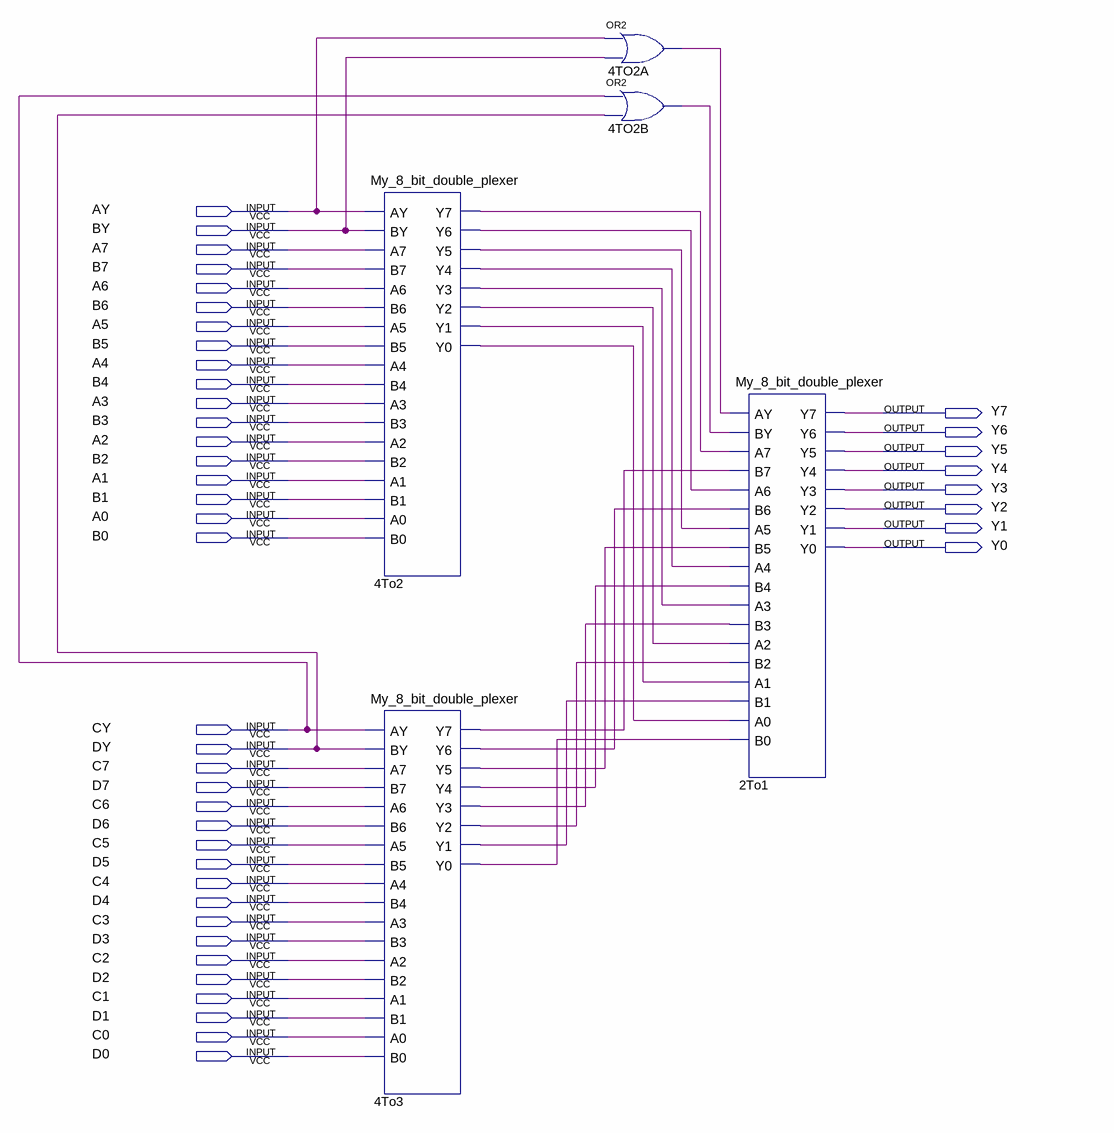
[diagram p0: schematic sheet]
// Quartus schematic My_8_bit_four_plexer.bdf as structural Verilog: 5 symbols, 44 pins
module My_8_bit_four_plexer (
  input  AY,
  input  BY,
  input  A7,
  input  B7,
  input  A6,
  input  B6,
  input  A5,
  input  B5,
  input  A4,
  input  B4,
  input  A3,
  input  B3,
  input  A2,
  input  B2,
  input  A1,
  input  B1,
  input  A0,
  input  B0,
  input  CY,
  input  DY,
  input  C7,
  input  D7,
  input  C6,
  input  D6,
  input  C5,
  input  D5,
  input  C4,
  input  D4,
  input  C3,
  input  D3,
  input  C2,
  input  D2,
  input  C1,
  input  D1,
  input  C0,
  input  D0,
  output Y7,
  output Y6,
  output Y5,
  output Y4,
  output Y3,
  output Y2,
  output Y1,
  output Y0
);

  wire n4To2_y0, n4To2_y1, n4To2_y2, n4To2_y3, n4To2_y4, n4To2_y5, n4To2_y6, n4To2_y7, n4TO2A_out,
       n4TO2B_out, n4To3_y0, n4To3_y1, n4To3_y2, n4To3_y3, n4To3_y4, n4To3_y5, n4To3_y6, n4To3_y7;

  My_8_bit_double_plexer u_4To2 (
    .AY(AY), .BY(BY), .A7(A7), .B7(B7), .A6(A6), .B6(B6), .A5(A5), .B5(B5), .A4(A4), .B4(B4), .A3(A3),
    .B3(B3), .A2(A2), .B2(B2), .A1(A1), .B1(B1), .A0(A0), .B0(B0), .Y7(n4To2_y7), .Y6(n4To2_y6),
    .Y5(n4To2_y5), .Y4(n4To2_y4), .Y3(n4To2_y3), .Y2(n4To2_y2), .Y1(n4To2_y1), .Y0(n4To2_y0));
  My_8_bit_double_plexer u_4To3 (
    .AY(CY), .BY(DY), .A7(C7), .B7(D7), .A6(C6), .B6(D6), .A5(C5), .B5(D5), .A4(C4), .B4(D4), .A3(C3),
    .B3(D3), .A2(C2), .B2(D2), .A1(C1), .B1(D1), .A0(C0), .B0(D0), .Y7(n4To3_y7), .Y6(n4To3_y6),
    .Y5(n4To3_y5), .Y4(n4To3_y4), .Y3(n4To3_y3), .Y2(n4To3_y2), .Y1(n4To3_y1), .Y0(n4To3_y0));
  or u_4TO2A (n4TO2A_out, AY, BY);
  or u_4TO2B (n4TO2B_out, CY, DY);
  My_8_bit_double_plexer u_2To1 (
    .AY(n4TO2A_out), .BY(n4TO2B_out), .A7(n4To2_y7), .B7(n4To3_y7), .A6(n4To2_y6), .B6(n4To3_y6),
    .A5(n4To2_y5), .B5(n4To3_y5), .A4(n4To2_y4), .B4(n4To3_y4), .A3(n4To2_y3), .B3(n4To3_y3), .A2(n4To2_y2),
    .B2(n4To3_y2), .A1(n4To2_y1), .B1(n4To3_y1), .A0(n4To2_y0), .B0(n4To3_y0), .Y7(Y7), .Y6(Y6), .Y5(Y5),
    .Y4(Y4), .Y3(Y3), .Y2(Y2), .Y1(Y1), .Y0(Y0));
endmodule
